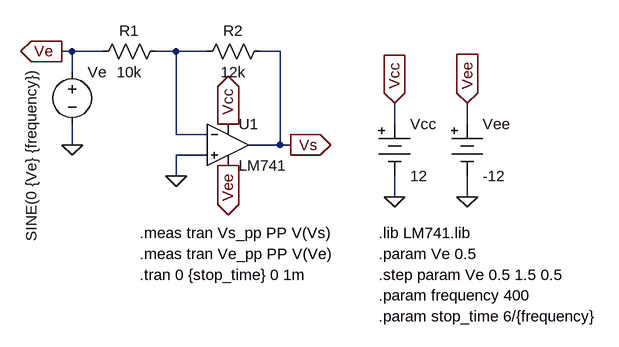
[diagram p0: schematic Exp3.asc]
Exp3.asc, the LTspice schematic file:
Version 4.1
SHEET 1 2388 680
WIRE -48 16 -64 16
WIRE 0 16 -48 16
WIRE 112 16 80 16
WIRE 160 16 112 16
WIRE 272 16 240 16
WIRE -48 48 -48 16
WIRE 448 128 448 96
WIRE 560 128 560 96
WIRE 112 144 112 16
WIRE 160 144 112 144
WIRE -48 160 -48 128
WIRE 272 160 272 16
WIRE 272 160 224 160
WIRE 288 160 272 160
WIRE 160 176 112 176
WIRE 112 208 112 176
WIRE 448 240 448 208
WIRE 560 240 560 208
FLAG 560 96 Vee
IOPIN 560 96 In
FLAG 448 96 Vcc
IOPIN 448 96 In
FLAG 192 128 Vcc
IOPIN 192 128 Out
FLAG 192 192 Vee
IOPIN 192 192 Out
FLAG -48 160 0
FLAG 448 240 0
FLAG 560 240 0
FLAG 288 160 Vs
IOPIN 288 160 Out
FLAG -64 16 Ve
IOPIN -64 16 Out
FLAG 112 208 0
SYMBOL OpAmps\\LM741 192 96 R0
SYMATTR InstName U1
SYMBOL voltage -48 32 R0
WINDOW 123 0 0 Left 0
WINDOW 39 0 0 Left 0
WINDOW 3 -63 9 VRight 2
SYMATTR Value SINE(0 {Ve} {frequency})
SYMATTR InstName Ve
SYMBOL Misc\\battery 448 112 R0
SYMATTR InstName Vcc
SYMATTR Value 12
SYMBOL Misc\\battery 560 112 R0
SYMATTR InstName Vee
SYMATTR Value -12
SYMBOL res 96 0 R90
WINDOW 0 0 56 VBottom 2
WINDOW 3 32 56 VTop 2
SYMATTR InstName R1
SYMATTR Value 10k
SYMBOL res 256 0 R90
WINDOW 0 0 56 VBottom 2
WINDOW 3 32 56 VTop 2
SYMATTR InstName R2
SYMATTR Value 12k
TEXT 424 328 Left 2 !.param Ve 0.5
TEXT 424 360 Left 2 !.step param Ve 0.5 1.5 0.5
TEXT 56 296 Left 2 !.meas tran Vs_pp PP V(Vs)
TEXT 424 392 Left 2 !.param frequency 400
TEXT 56 360 Left 2 !.tran 0 {stop_time} 0 1m
TEXT 424 424 Left 2 !.param stop_time 6/{frequency}
TEXT 56 328 Left 2 !.meas tran Ve_pp PP V(Ve)
TEXT 424 296 Left 2 !.lib LM741.lib

The netlist it stands for:
* Exp3.asc
X§U1 0 N001 Vcc Vee Vs LM741  ; pins In+ In- V+ V- OUT
Ve Ve 0 SINE(0 {Ve} {frequency})
Vcc Vcc 0 12
Vee Vee 0 -12
R1 N001 Ve 10k
R2 Vs N001 12k
.param Ve 0.5
.step param Ve 0.5 1.5 0.5
.meas tran Vs_pp PP V(Vs)
.param frequency 400
.tran 0 {stop_time} 0 1m
.param stop_time 6/{frequency}
.meas tran Ve_pp PP V(Ve)
.lib LM741.lib
.lib LM741.lib
.backanno
.end